# Altium schematic sheet 07-USB_HOST.SchDoc
size B
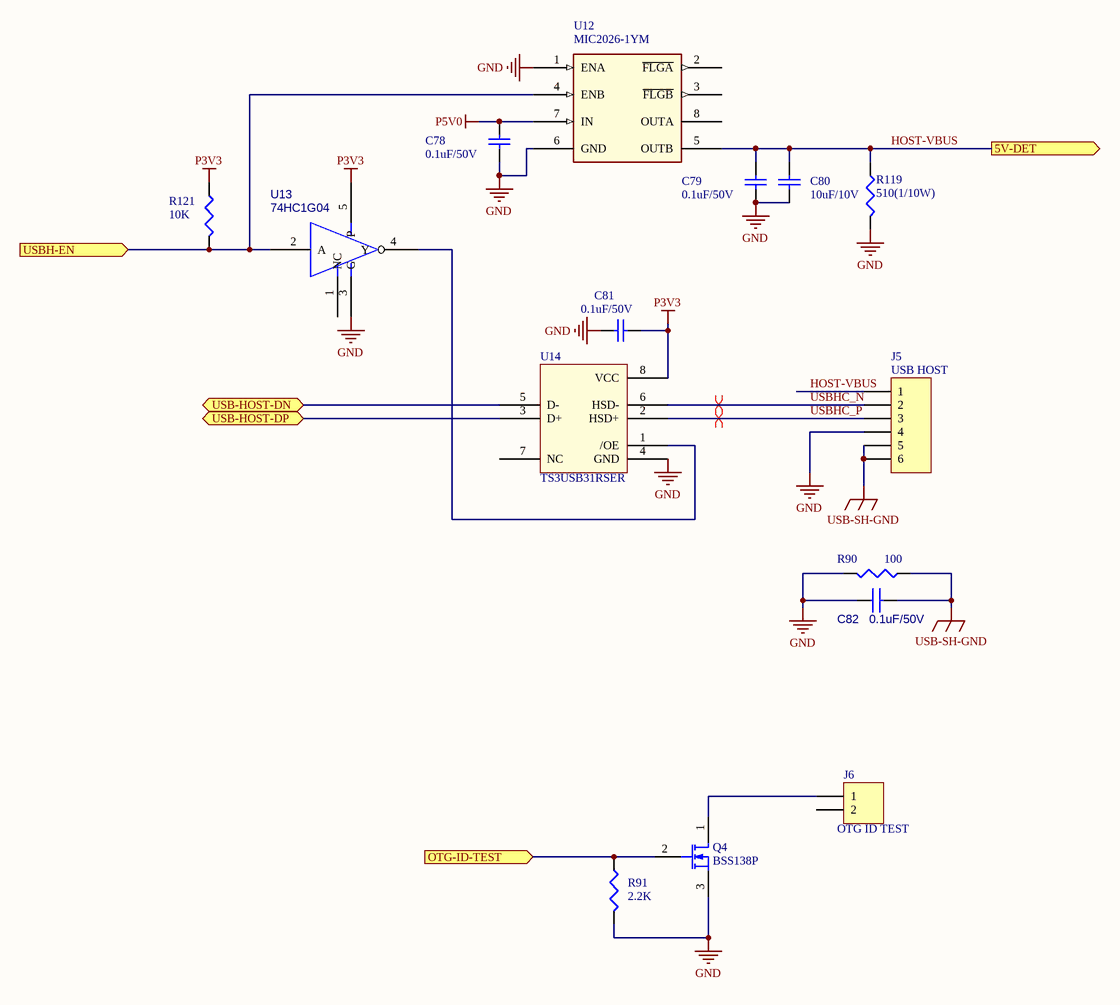
[diagram p0: 07-USB_HOST.SchDoc]

## Parts
C78  0.1uF/50V  [0402]
C79  0.1uF/50V  [0402]
C80  10uF/10V  [0805]
C81  0.1uF/50V  [0402]
C82  0.1uF/50V  [0402]
J5  USB HOST  [USB-HOST]
J6  OTG ID TEST  [3030WR-S-2*1P]
Q4  BSS138P  [NPN]
R90  100  [0402]
R91  2.2K  [0402]
R119  510(1/10W)  [0805]
R121  10K  [0402]
U12  MIC2026-1YM  [SO8]
U13  74HC1G04  [SOT753]
U14  TS3USB31RSER  [UQFN8]

## Ports
5V-DET (out), OTG-ID-TEST (in), USB-HOST-DN (bidir), USB-HOST-DP (bidir), USBH-EN (in)

## Nets
GND: C78.2 C79.2 C80.2 C81.2 C82.1 J5.4 Q4.3(S) R90.2 R91.2 R119.2 U12.1(ENA) U12.6(GND) U13.3(G) U14.4(GND)
P3V3: C81.1 R121.1 U13.5(P) U14.8(VCC)
P5V0: C78.1 U12.7(IN)
USB-SH-GND: C82.2 J5.5 J5.6 R90.1
HOST-VBUS: C79.1 C80.1 J5.1 R119.1 U12.5(OUTB) ; port 5V-DET
OTG-ID-TEST: Q4.2(G) R91.1 ; port OTG-ID-TEST
USB-HOST-DN: U14.5(D-) ; port USB-HOST-DN
USB-HOST-DP: U14.3(D+) ; port USB-HOST-DP
USBH-EN: R121.2 U12.4(ENB) U13.2(A) ; port USBH-EN
USBHC_N: J5.2 U14.6(HSD-)
USBHC_P: J5.3 U14.2(HSD+)
NetJ6_1: J6.1 Q4.1(D)
NetU13_4: U13.4(Y) U14.1(/OE)

Not connected (* = marked no-connect by the designer): J6 2; U12 2(~{FLGA}) 3(~{FLGB}) 8(OUTA); U13 1(NC); U14 7(NC)

## Layout directives
differential pair: USBHC_N, USBHC_P

## Library data of the parts
C78-C81 = Cap: Capacitor; Published: 8-Jun-2000; LatestRevisionDate: 17-Jul-2002; LatestRevisionNote: Re-released for DXP Platform.; PackageReference: RAD-0.3; Publisher: Altium Limited; PackageDescription: Radial Cap, Thru-Hole; 2 Leads; 0.3 in Pin Spacing
C82 = CAP_Dup1
J5 = Header 6: Header, 6-Pin
J6 = Header 2: Header, 2-Pin; LatestRevisionDate: 17-Jul-2002; LatestRevisionNote: Re-released for DXP Platform.; Publisher: Altium Limited
Q4 = MOSFET-N: N-Channel MOSFET; Published: 8-Jun-2000; LatestRevisionDate: 17-Jul-2002; LatestRevisionNote: Re-released for DXP Platform.; PackageVersion: 1995/1996; PackageReference: E3; Publisher: Altium Limited; PackageDescription: TO, Flat Index; 3 In-Line, Axial Leads; Body Dia. 4.6mm; Lead Dia. 0.5 mm (max)
R90 R119 R121 = CR16-1003FM
R91 = Res3: Resistor; Value: 0.1/1W; Published: 8-Jun-2000; LatestRevisionDate: 29-May-2009; LatestRevisionNote: IPC-7351 Footprint Added.; PackageReference: J1-0603; Publisher: Altium Limited; PackageDescription: Chip Resistor
U12 = MIC2526_8P: IC LIN SW PWR ACTIVE HIGH DUAL 2.7V-5.5V 0.5A SOIC8; CAD_APPROVED: Yes; MFG_NAME01: MICREL; AGILE_PN: 312-75936; CLASS: IC; HEIGHT: 1.73mm; ROHS: Yes; MFG_PN01: MIC2026-1YM
U13 = 74LVC1G04GW_SOT353-5: Part  Number: SA00000FX00